# Altium project Mainboard.PrjPCB
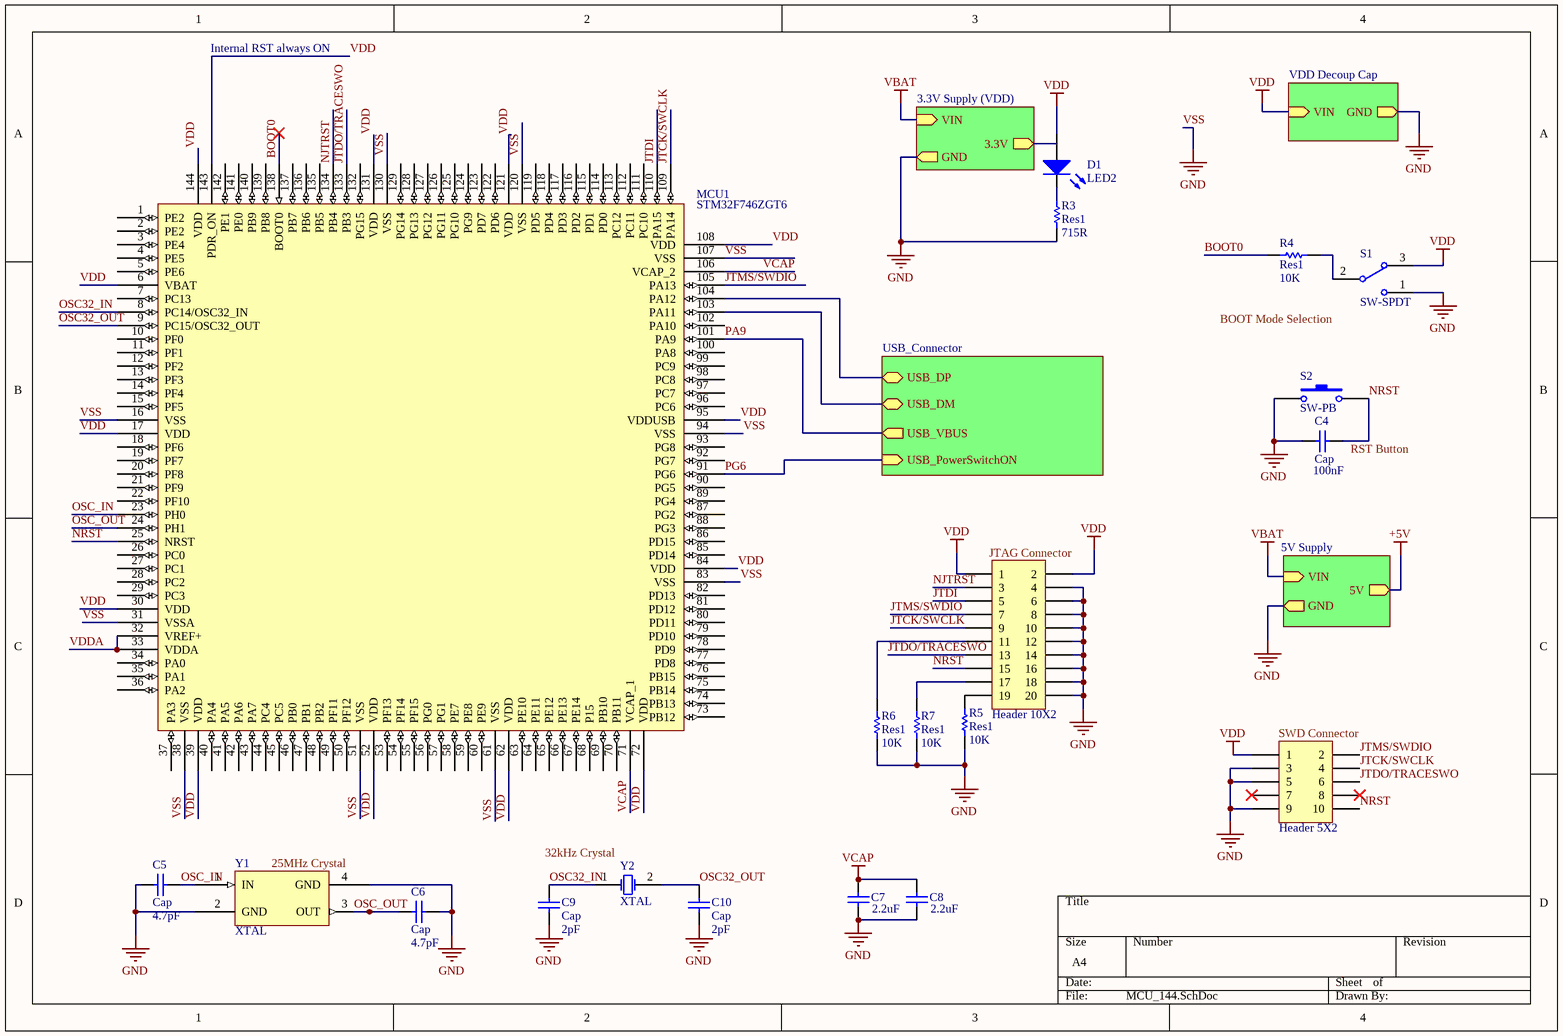
[diagram p0: MCU_144.SchDoc]
5 sheets, 52 parts. Net scope: hierarchical (ports join the sheet entries above them; power ports are global).
Sheets:
  MCU_144.SchDoc
    3.3V Supply (VDD) = 3.3V_Regulator.SchDoc
    VDD Decoup Cap = Decoupling_Capacitors.SchDoc
    5V Supply = 5V_Regulator.SchDoc
    USB_Connector = USB.SchDoc

## Sheet MCU_144.SchDoc
size A4

### Parts
C4  Cap  value 100nF  [0402]
C5  Cap  value 4.7pF  [RAD-0.3]
C6  Cap  value 4.7pF  [RAD-0.3]
C7  value 2.2uF  [0402]  (hidden comment: Cap)
C8  value 2.2uF  [0402]  (hidden comment: Cap)
C9  Cap  value 2pF  [RAD-0.3]
C10  Cap  value 2pF  [RAD-0.3]
D1  LED2  [3.2X1.6X1.1]
MCU1  STM32F746ZGT6  [LQFP144]
P1  Header 10X2  [HDR2X10]
P2  Header 5X2  [HDR2X5]
R3  Res1  value 715R  [AXIAL-0.3]
R4  Res1  value 10K  [RES0402]
R5  Res1  value 10K  [RES0402]
R6  Res1  value 10K  [RES0402]
R7  Res1  value 10K  [RES0402]
S1  SW-SPDT  [TL36WW15050]
S2  SW-PB  [SPST-2]
Y1  XTAL
Y2  XTAL  [R38]

### Sub-sheets
3.3V Supply (VDD) = 3.3V_Regulator.SchDoc: VIN (in), GND (out), 3.3V (out)
5V Supply = 5V_Regulator.SchDoc: VIN (in), GND (out), 5V (out)
USB_Connector = USB.SchDoc: USB_PowerSwitchON (in), USB_VBUS (out), USB_DP (bidir), USB_DM (bidir)
VDD Decoup Cap = Decoupling_Capacitors.SchDoc: VIN (in), GND (out)

### Nets
VBAT: sheet 3.3V Supply (VDD)/VIN, sheet 5V Supply/VIN
VCAP: C7.2 C8.2 MCU1.71(VCAP_1) MCU1.106(VCAP_2)
VDD: D1.1(A) MCU1.6(VBAT) MCU1.17(VDD) MCU1.30(VDD) MCU1.39(VDD) MCU1.52(VDD) MCU1.62(VDD) MCU1.72(VDD) MCU1.84(VDD) MCU1.95(VDDUSB) MCU1.108(VDD) MCU1.121(VDD) MCU1.131(VDD) MCU1.143(PDR_ON) MCU1.144(VDD) P1.1 P1.2 P2.1 S1.3 ; sheet VDD Decoup Cap/VIN
VSS: C4.1 C5.2 C6.1 C7.1 C8.1 C9.1 C10.1 MCU1.16(VSS) MCU1.31(VSSA) MCU1.38(VSS) MCU1.51(VSS) MCU1.61(VSS) MCU1.83(VSS) MCU1.94(VSS) MCU1.107(VSS) MCU1.120(VSS) MCU1.130(VSS) P1.4 P1.6 P1.8 P1.10 P1.12 P1.14 P1.16 P1.18 P1.20 P2.3 P2.5 P2.9 R3.1 R5.1 R6.1 R7.1 S1.1 S2.1 Y1.2(GND) Y1.4(GND) ; sheet 3.3V Supply (VDD)/GND, sheet VDD Decoup Cap/GND, sheet 5V Supply/GND  [also labelled GND]
BOOT0: MCU1.138(BOOT0) R4.2
JTCK/SWCLK: MCU1.109(PA14) P1.9 P2.4
JTDI: MCU1.110(PA15) P1.5
JTDO/TRACESWO: MCU1.133(PB3) P1.13 P2.6
JTMS/SWDIO: MCU1.105(PA13) P1.7 P2.2
NJTRST: MCU1.134(PB4) P1.3
NRST: C4.2 MCU1.25(NRST) P1.15 P2.10 S2.2
OSC32_IN: C9.2 MCU1.8(PC14/OSC32_IN) Y2.1(OSC1)
OSC32_OUT: C10.2 MCU1.9(PC15/OSC32_OUT) Y2.2(OSC2)
OSC_IN: C5.1 MCU1.23(PH0) Y1.1(IN)
OSC_OUT: C6.2 MCU1.24(PH1) Y1.3(OUT)
PA9: MCU1.101(PA9) ; sheet USB_Connector/USB_VBUS
PG6: MCU1.91(PG6) ; sheet USB_Connector/USB_PowerSwitchON
USB_FS_N: MCU1.103(PA11) ; sheet USB_Connector/USB_DM
USB_FS_P: MCU1.104(PA12) ; sheet USB_Connector/USB_DP
VDDA: MCU1.32(VREF+) MCU1.33(VDDA)
NetD1_2: D1.2(K) R3.2
NetP1_11: P1.11 R6.2
NetP1_17: P1.17 R7.2
NetP1_19: P1.19 R5.2
NetR4_1: R4.1 S1.2

Not connected (* = marked no-connect by the designer): MCU1 1(PE2) 2(PE2) 3(PE4) 4(PE5) 5(PE6) 7(PC13) 10(PF0) 11(PF1) 12(PF2) 13(PF3) 14(PF4) 15(PF5) 18(PF6) 19(PF7) 20(PF8) 21(PF9) 22(PF10) 26(PC0) 27(PC1) 28(PC2) 29(PC3) 34(PA0) 35(PA1) 36(PA2) 37(PA3) 40(PA4) 41(PA5) 42(PA6) 43(PA7) 44(PC4) 45(PC5) 46(PB0) 47(PB1) 48(PB2) 49(PF11) 50(PF12) 53(PF13) 54(PF14) 55(PF15) 56(PG0) 57(PG1) 58(PE7) 59(PE8) 60(PE9) 63(PE10) 64(PE11) 65(PE12) 66(PE13) 67(PE14) 68(P15) 69(PB10) 70(PB11) 73(PB12) 74(PB13) 75(PB14) 76(PB15) 77(PD8) 78(PD9) 79(PD10) 80(PD11) 81(PD12) 82(PD13) 85(PD14) 86(PD15) 87(PG2) 88(PG3) 89(PG4) 90(PG5) 92(PG7) 93(PG8) 96(PC6) 97(PC7) 98(PC8) 99(PC9) 100(PA8) 102(PA10) 111(PC10) 112(PC11) 113(PC12) 114(PD0) 115(PD1) 116(PD2) 117(PD3) 118(PD4) 119(PD5) 122(PD6) 123(PD7) 124(PG9) 125(PG10) 126(PG11) 127(PG12) 128(PG13) 129(PG14) 132(PG15) 135(PB5) 136(PB6) 137(PB7) 139(PB8) 140(PB9) 141(PE0) 142(PE1); P2 7* 8*

### Notes on the sheet
- Internal RST always ON
- (near S1) BOOT Mode Selection
- (near C4) RST Button
- (near P1) JTAG Connector
- (near P2) SWD Connector
- 32kHz Crystal
- (near Y1) 25MHz Crystal

### Library data of the parts
C4 = Cap: Multilayer Ceramic Capacitors MLCC - SMD/SMT 16volts 0.1uF 20% X7R; Mfr. No: C0402C104M4RACAUTO; PackageReference: SMD-0402 (1005 metric); PackageDescription: Ceramic Capacitor; Mouser No: 80-C0402C104M4RAUTO
C5 C6 C9 C10 = Cap: Capacitor; Published: 8-Jun-2000; LatestRevisionDate: 17-Jul-2002; LatestRevisionNote: Re-released for DXP Platform.; PackageReference: RAD-0.3; Publisher: Altium Limited; PackageDescription: Radial Cap, Thru-Hole; 2 Leads; 0.3 in Pin Spacing
C7 C8 = Cap: Multilayer Ceramic Capacitors MLCC - SMD/SMT 0402 2.2uF 6.3volts X5R 10%; Mfr. No: GRM155R60J225KE95D; PackageReference: SMD-0402(1005 metric); PackageDescription: Ceramic Capacitor; Mouser No: 81-GRM155R60J225KE5D
D1 = LED2: Typical RED, GREEN, YELLOW, AMBER GaAs LED; Published: 8-Jun-2000; LatestRevisionDate: 17-Jul-2002; LatestRevisionNote: Re-released for DXP Platform.; PackageVersion: Feb-2002; PackageReference: 3.2X1.6X1.1; Publisher: Altium Limited; PackageDescription: SM LED; 2 Flat Leads
MCU1 = STM32F746ZGT6: ARM Microcontrollers - MCU High-performance and DSP with FPU ARM Cortex-M7 MCU with 1 Mbyte Flash, 216 MHz CPU, Art Accelerator, L1 cache, SDRAM, TFT; Mfr. No: STM32F746ZGT6; Mouser No: 511-STM32F746ZGT6
P1 = Header 10X2: Header, 10-Pin, Dual row; LatestRevisionDate: 17-Jul-2002; LatestRevisionNote: Re-released for DXP Platform.; Publisher: Altium Limited
P2 = Header 5X2: Header, 5-Pin, Dual row; LatestRevisionDate: 17-Jul-2002; LatestRevisionNote: Re-released for DXP Platform.; Publisher: Altium Limited
R3 = Res1: Resistor; Published: 8-Jun-2000; LatestRevisionDate: 17-Jul-2002; LatestRevisionNote: Re-released for DXP Platform.; PackageReference: AXIAL-0.3; Publisher: Altium Limited; PackageDescription: Axial Device, Thru-Hole; 2 Leads; 0.3 in Pin Spacing
R4-R7 = Res1: Thick Film Resistors - SMD 0.2watt 10Kohms 1% 100ppm; Mfr. No: RCS040210K0FKED; PackageReference: SMD-0402(1005 metric); PackageDescription: Chip Resistor; Mouser No: 71-RCS040210K0FKED
S1 = SW-SPDT: SPDT Subminiature Toggle Switch, Right Angle Mounting, Vertical Actuation; Published: 24-Mar-1999; LatestRevisionDate: 17-Dec-2003; LatestRevisionNote: Schematic revised, PCB Footprint replaced.; DatasheetVersion: 05-Dec-2000; PackageReference: TL36WW15050; Publisher: Altium Limited; PackageDescription: Switch; 4 Leads; ComponentLink1Description: Manufacturer Link; ComponentLink1URL: http://www.apem.com
S2 = SW-PB: Switch; Published: 24-Mar-1999; LatestRevisionDate: 17-Jul-2002; LatestRevisionNote: Re-released for DXP Platform.; PackageReference: SPST-2; Publisher: Altium Limited; PackageDescription: Switch; 2 Leads
Y1 = ECX-2236Q: 25MHz Crystal Oscilator
Y2 = XTAL: Crystal Oscillator; Published: 8-Jun-2000; LatestRevisionDate: 17-Jul-2002; LatestRevisionNote: Re-released for DXP Platform.; PackageReference: R38; Publisher: Altium Limited; PackageDescription: Crystal, Thru-Hole; 2 Leads; Body 3.1 x 8.2 mm (Dia.xH)

## Sheet 3.3V_Regulator.SchDoc
size A4
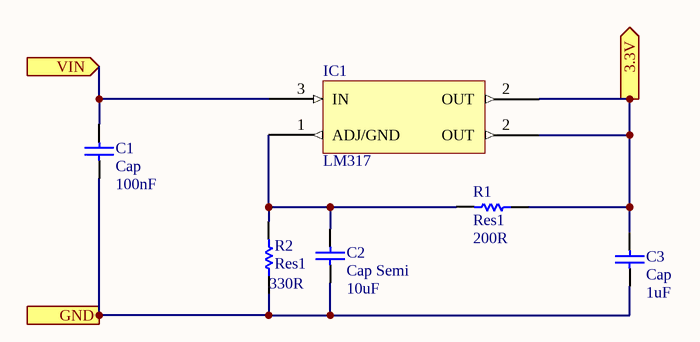
[diagram p1: 3.3V_Regulator.SchDoc]

### Parts
C1  Cap  value 100nF  [0402]
C2  Cap Semi  value 10uF  [CAP_TANT1206]
C3  Cap  value 1uF  [CAP_TANT1206]
IC1  LM317  [SOT-223]
R1  Res1  value 200R  [RES0402]
R2  Res1  value 330R  [RES0402]

### Ports
3.3V (out), GND (out), VIN (in)

### Nets
VBAT: C1.2 IC1.3(IN) ; port VIN
VSS: C1.1 C2.1 C3.1 R2.1 ; port GND
NetC2_2: C2.2 IC1.1(ADJ/GND) R1.2 R2.2
NetC3_2: C3.2 IC1.2(OUT) R1.1 ; port 3.3V

### Library data of the parts
C1 = Cap: as C4 on sheet MCU_144; PackageReference: SMD-0402 (1005 metric); PackageDescription: Ceramic Capacitor; Mouser No: 80-C0402C104M4RAUTO
C2 = Cap Semi: Tantalum Capacitors - Solid SMD 16V 10uF 1206 10% ESR=3Ohms; Mfr. No: T491A106K016AT; PackageReference: SMD-1206(3216 metric); PackageDescription: Tantalum Capacitor; Mouser No: 80-T491A106K016
C3 = Cap: Tantalum Capacitors - Solid SMD 20V 1.0uF 1206 10% ESR=9Ohms; Mfr. No: T491A105K020AT; PackageReference: SMD-1206(3216 metric); PackageDescription: Tantalum Capacitor; Mouser No: 80-T491A105K020
R1 = Res1: Thick Film Resistors - SMD 1/16watt 200ohms 5%; Mfr. No: CRCW0402200RJNED; PackageReference: SMD-0402 (1005 metric); PackageDescription: Chip Resistor; Mouser No: 71-CRCW0402J-200-E3
R2 = Res1: Thick Film Resistors - SMD 0.2watt 330ohms 1% 100ppm; Mfr. No: RCS0402330RFKED; PackageReference: SMD-0402(1005 metric); PackageDescription: Chip Resistor; Mouser No: 71-RCS0402330RFKED

## Sheet Decoupling_Capacitors.SchDoc
size A4
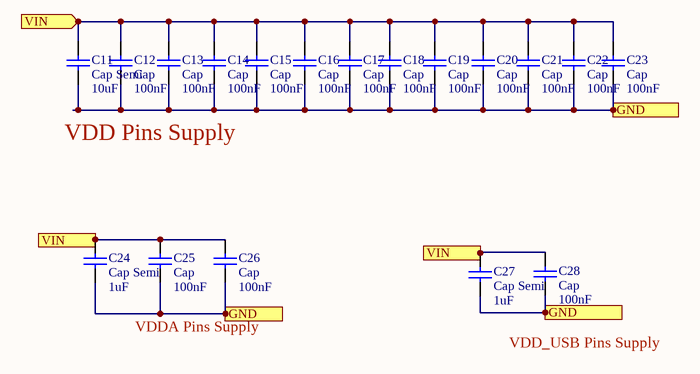
[diagram p2: Decoupling_Capacitors.SchDoc]

### Parts
C11  Cap Semi  value 10uF  [CAP_TANT1206]
C12  Cap  value 100nF  [0402]
C13  Cap  value 100nF  [0402]
C14  Cap  value 100nF  [0402]
C15  Cap  value 100nF  [0402]
C16  Cap  value 100nF  [0402]
C17  Cap  value 100nF  [0402]
C18  Cap  value 100nF  [0402]
C19  Cap  value 100nF  [0402]
C20  Cap  value 100nF  [0402]
C21  Cap  value 100nF  [0402]
C22  Cap  value 100nF  [0402]
C23  Cap  value 100nF  [0402]
C24  Cap Semi  value 1uF  [0402]
C25  Cap  value 100nF  [0402]
C26  Cap  value 100nF  [0402]
C27  Cap Semi  value 1uF  [0402]
C28  Cap  value 100nF  [0402]

### Ports
GND (out), VIN, VIN (in)

### Nets
VDD: C11.2 C12.2 C13.2 C14.2 C15.2 C16.2 C17.2 C18.2 C19.2 C20.2 C21.2 C22.2 C23.2 C24.2 C25.2 C26.2 C27.2 C28.2 ; port VIN
VSS: C11.1 C12.1 C13.1 C14.1 C15.1 C16.1 C17.1 C18.1 C19.1 C20.1 C21.1 C22.1 C23.1 C25.1 C26.1 C27.1 C28.1 ; port GND

Not connected (* = marked no-connect by the designer): C24 1

### Notes on the sheet
- VDD Pins Supply
- VDDA Pins Supply
- VDD_USB Pins Supply

### Library data of the parts
C11 = Cap Semi: as C2 on sheet 3.3V_Regulator; PackageReference: SMD-1206(3216 metric); PackageDescription: Tantalum Capacitor; Mouser No: 80-T491A106K016
C12-C23 C25 C26 C28 = Cap: as C4 on sheet MCU_144; PackageReference: SMD-0402 (1005 metric); PackageDescription: Ceramic Capacitor; Mouser No: 80-C0402C104M4RAUTO
C24 C27 = Cap Semi: Multilayer Ceramic Capacitors MLCC - SMD/SMT CGB 0402 16V 1uF JB 20%; Mfr. No: CGB2A1JB1C105M033BC; PackageReference: SMD-0402(1005 metric); PackageDescription: Chip Capacitor; Mouser No: 810-CGB2A1JB1C105M0C

## Sheet 5V_Regulator.SchDoc
size A4
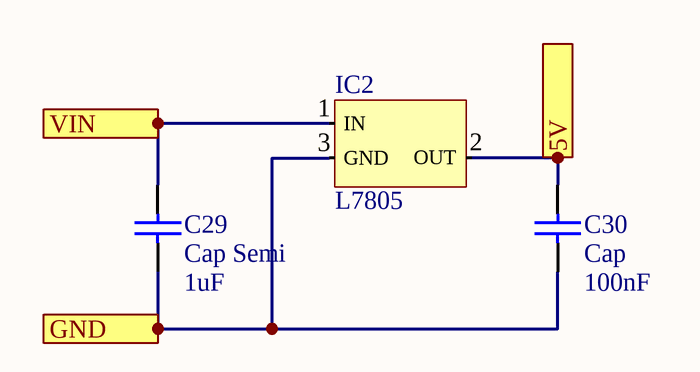
[diagram p3: 5V_Regulator.SchDoc]

### Parts
C29  Cap Semi  value 1uF  [0402]
C30  Cap  value 100nF  [0402]
IC2  L7805  [D2PAK]

### Ports
5V (out), GND (out), VIN (in)

### Nets
+5V: C30.2 IC2.2(OUT) ; port 5V
VBAT: C29.2 IC2.1(IN) ; port VIN
VSS: C29.1 C30.1 IC2.3(GND) ; port GND

### Library data of the parts
C29 = Cap Semi: as C24 on sheet Decoupling_Capacitors; PackageReference: SMD-0402(1005 metric); PackageDescription: Chip Capacitor; Mouser No: 810-CGB2A1JB1C105M0C
C30 = Cap: as C4 on sheet MCU_144; PackageReference: SMD-0402 (1005 metric); PackageDescription: Ceramic Capacitor; Mouser No: 80-C0402C104M4RAUTO
IC2 = L7805ACD2T-TR: Linear Voltage Regulators 5.0V 1.0A Positive; Mfr. No: L7805CD2T-TR; Mouser No: 511-L7805CD2T-TR

## Sheet USB.SchDoc
size A4
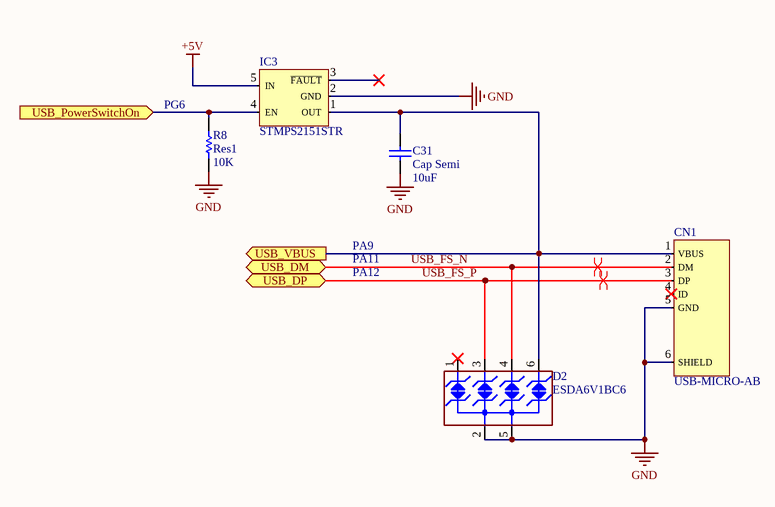
[diagram p4: USB.SchDoc]

### Parts
C31  Cap Semi  value 10uF  [CAP_TANT1206]
CN1  USB-MICRO-AB  [USB-MICRO-AB]
D2  ESDA6V1BC6  [SOT23-6L]
IC3  STMPS2151STR  [SOT23-5L]
R8  Res1  value 10K  [RES0402]

### Ports
USB_DM (bidir), USB_DP (bidir), USB_PowerSwitchOn (in), USB_VBUS (out)

### Nets
+5V: IC3.5(IN)
GND: C31.1 CN1.5(GND) CN1.6(SHIELD) D2.2(IO2) D2.5(IO4) IC3.2(GND) R8.1  [project net VSS]
PA9: C31.2 CN1.1(VBUS) D2.6(NC) IC3.1(OUT) ; port USB_VBUS
PG6: IC3.4(EN) R8.2 ; port USB_PowerSwitchOn
USB_FS_N: CN1.2(DM) D2.4(IO3) ; port USB_DM
USB_FS_P: CN1.3(DP) D2.3(GND) ; port USB_DP

Not connected (* = marked no-connect by the designer): CN1 4(ID)*; D2 1(IO1)*; IC3 3(~{FAULT})*

### Layout directives
differential pair: USB_FS_N, USB_FS_P

### Notes on the sheet
- (near R8) PG6
- PA11
- PA9
- PA12

### Library data of the parts
C31 = Cap Semi: as C2 on sheet 3.3V_Regulator; PackageReference: SMD-1206(3216 metric); PackageDescription: Tantalum Capacitor; Mouser No: 80-T491A106K016
CN1 = USB-MICRO-AB: USB Connectors WR-COM USB Micro SMT Type AB Horiztl; Mfr. No: 629105150921; Mouser No: 710-629105150921
D2 = ESDA6V1BC6: ESD Suppressors / TVS Diodes 6.1V 80W Bidirect; Manuf_1: STM; Manuf_Part_1: ESDA5V3L; Ref St: 9179034; Provided: ST; ECCN_US/EU: EAR99/NEC; Distrib: ST; Order: ESDA5V3L; Ordered by: STM; Mfr. No: ESDA6V1BC6; Mouser No: 511-ESDA6V1BC6
IC3 = STMPS215: Power Switch ICs - Power Distribution SGL CHNL PWR SWTCH; Mfr. No: STMPS2151STR; Mouser No: 511-STMPS2151STR
R8 = Res1: as R4 on sheet MCU_144; PackageReference: SMD-0402(1005 metric); PackageDescription: Chip Resistor; Mouser No: 71-RCS040210K0FKED

## Nets that join several sheets
+5V: 5V_Regulator (C30.2 IC2.2), USB (IC3.5)
VBAT: 3.3V_Regulator (C1.2 IC1.3), 5V_Regulator (C29.2 IC2.1)
VDD: MCU_144 (19 pins), Decoupling_Capacitors (18 pins)
VSS: MCU_144 (37 pins), 3.3V_Regulator (C1.1 C2.1 C3.1 R2.1), Decoupling_Capacitors (17 pins), 5V_Regulator (C29.1 C30.1 IC2.3), USB (7 pins)
PA9: MCU_144 (MCU1.101), USB (C31.2 CN1.1 D2.6 IC3.1)
PG6: MCU_144 (MCU1.91), USB (IC3.4 R8.2)
USB_FS_N: MCU_144 (MCU1.103), USB (CN1.2 D2.4)
USB_FS_P: MCU_144 (MCU1.104), USB (CN1.3 D2.3)